# EAGLE design ESP32-S3 Parallel TFT 3.16“ ST7701S v1.0 (EAGLE 6.1)
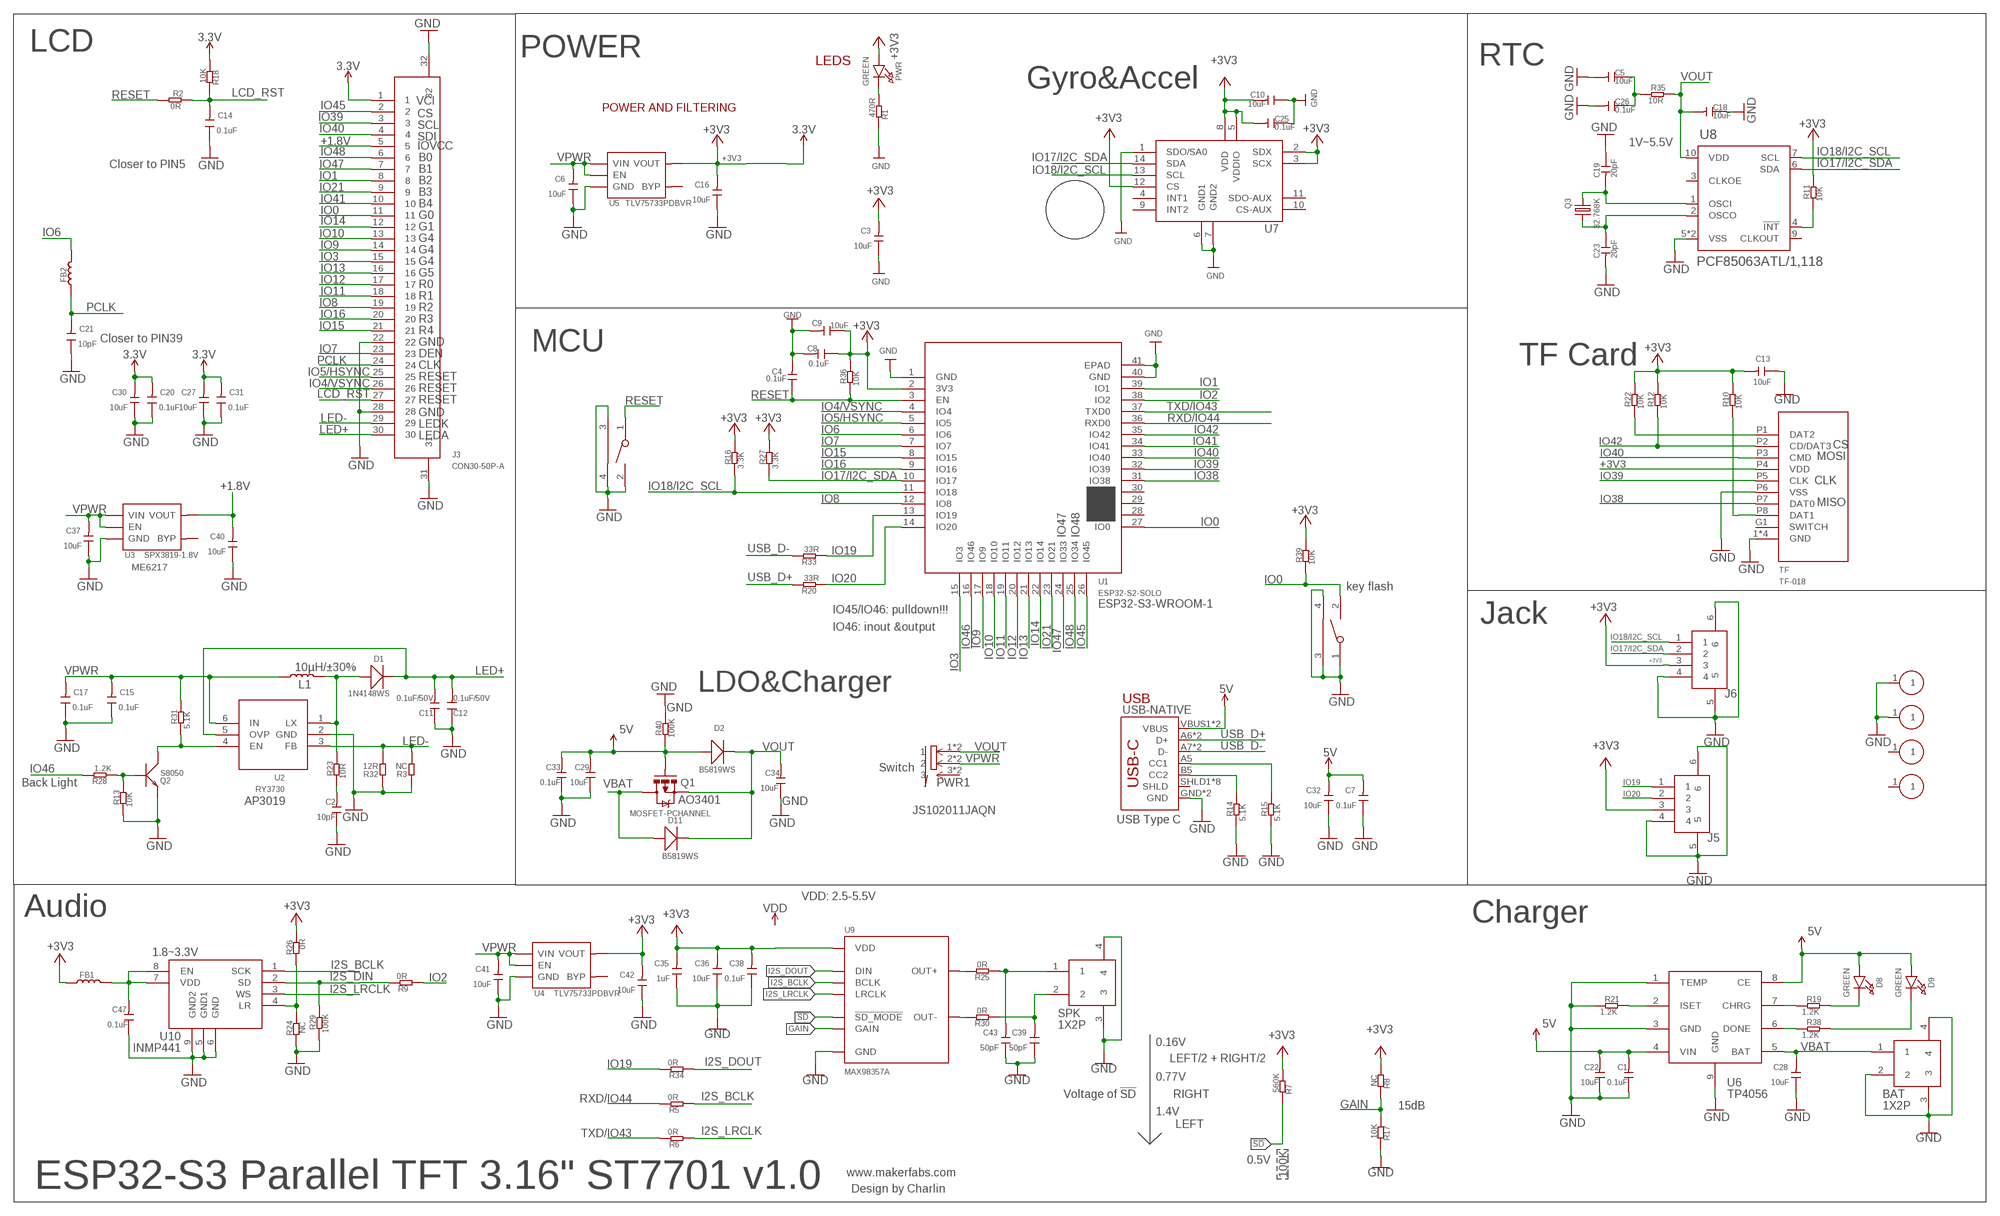
[diagram p0: schematic, sheet 1]

## Parts
BAT  1X2P  [1X2P-SMT1.25MM]
C1  0.1uF  DISCRETE_C-0402  [DISCRETE_C0402]
C2  10pF  DISCRETE_C-0402  [DISCRETE_C0402]
C3  10uF  DISCRETE_C-0402  [DISCRETE_C0402]
C4  0.1uF  DISCRETE_C-0402  [DISCRETE_C0402]
C5  10uF  DISCRETE_C-0402  [DISCRETE_C0402]
C6  10uF  DISCRETE_C-0402  [DISCRETE_C0402]
C7  0.1uF  DISCRETE_C-0402  [DISCRETE_C0402]
C8  0.1uF  DISCRETE_C-0402  [DISCRETE_C0402]
C9  10uF  DISCRETE_C-0402  [DISCRETE_C0402]
C10  10uF  DISCRETE_C-0402  [DISCRETE_C0402]
C11  0.1uF/50V  DISCRETE_C-0603  [DISCRETE_C0603]
C12  0.1uF/50V  DISCRETE_C-0603  [DISCRETE_C0603]
C13  10uF  DISCRETE_C-0402  [DISCRETE_C0402]
C14  0.1uF  DISCRETE_C-0402  [DISCRETE_C0402]
C15  0.1uF  DISCRETE_C-0402  [DISCRETE_C0402]
C16  10uF  DISCRETE_C-0402  [DISCRETE_C0402]
C17  0.1uF  DISCRETE_C-0402  [DISCRETE_C0402]
C18  10uF  DISCRETE_C-0402  [DISCRETE_C0402]
C19  20pF  DISCRETE_C-0402  [DISCRETE_C0402]
C20  0.1uF  DISCRETE_C-0402  [DISCRETE_C0402]
C21  10pF  DISCRETE_C-0402  [DISCRETE_C0402]
C22  10uF  DISCRETE_C-0402  [DISCRETE_C0402]
C23  20pF  DISCRETE_C-0402  [DISCRETE_C0402]
C25  0.1uF  DISCRETE_C-0402  [DISCRETE_C0402]
C26  0.1uF  DISCRETE_C-0402  [DISCRETE_C0402]
C27  10uF  DISCRETE_C-0402  [DISCRETE_C0402]
C28  10uF  DISCRETE_C-0402  [DISCRETE_C0402]
C29  10uF  DISCRETE_C-0402  [DISCRETE_C0402]
C30  10uF  DISCRETE_C-0402  [DISCRETE_C0402]
C31  0.1uF  DISCRETE_C-0402  [DISCRETE_C0402]
C32  10uF  DISCRETE_C-0402  [DISCRETE_C0402]
C33  0.1uF  DISCRETE_C-0402  [DISCRETE_C0402]
C34  10uF  DISCRETE_C-0402  [DISCRETE_C0402]
C35  1uF  DISCRETE_C-0402  [DISCRETE_C0402]
C36  10uF  DISCRETE_C-0402  [DISCRETE_C0402]
C37  10uF  DISCRETE_C-0402  [DISCRETE_C0402]
C38  0.1uF  DISCRETE_C-0402  [DISCRETE_C0402]
C39  50pF  DISCRETE_C-0402  [DISCRETE_C0402]
C40  10uF  DISCRETE_C-0402  [DISCRETE_C0402]
C41  10uF  DISCRETE_C-0402  [DISCRETE_C0402]
C42  10uF  DISCRETE_C-0402  [DISCRETE_C0402]
C43  50pF  DISCRETE_C-0402  [DISCRETE_C0402]
C47  0.1uF  DISCRETE_C-0402  [DISCRETE_C0402]
D1  1N4148WS  D'0805'  [SOD323]
D2  B5819WS  D'0805'  [SOD323]
D8  GREEN  LED0805_NOOUTLINE  [CHIPLED_0805_NOOUTLINE]
D9  GREEN  LED0805_NOOUTLINE  [CHIPLED_0805_NOOUTLINE]
D11  B5819WS  D'0805'  [SOD323]
FB1  L'0402'  [0402]
FB2  L'0402'  [0402]
FLASH  TS24CA  [2*4*3.5MM]
J3  CON30-50P-A  [SMD30-50P-1850L540W300H]
J5  CON4-100P-V  [SMD4-100P-635L374W374H]
J6  CON4-100P-V  [SMD4-100P-635L374W374H]
L1  10µH/±30%  INDUCTOR-CR54-3.3UH  [CR54]
PWR  GREEN  LED0805_NOOUTLINE  [CHIPLED_0805_NOOUTLINE]
PWR1  JS102011JAQN  [SMD-6-2.5MM]
Q1  MOSFET-PCHANNEL  [SOT23-3]
Q2  S8050  TRANSISTOR-NPN-SOT23  [SOT23]
Q3  32.768K  CRYSTAL_3215  [XTAL3215]
R1  470R  DISCRETE_R-0402  [DISCRETE_R0402]
R2  0R  DISCRETE_R-0402  [DISCRETE_R0402]
R3  NC  DISCRETE_R-0603  [DISCRETE_R0603]
R5  0R  DISCRETE_R-0402  [DISCRETE_R0402]
R6  0R  DISCRETE_R-0402  [DISCRETE_R0402]
R7  560K  DISCRETE_R-0402  [DISCRETE_R0402]
R8  NC  DISCRETE_R-0402  [DISCRETE_R0402]
R9  0R  DISCRETE_R-0402  [DISCRETE_R0402]
R10  10K  DISCRETE_R-0402  [DISCRETE_R0402]
R11  10K  DISCRETE_R-0402  [DISCRETE_R0402]
R12  10K  DISCRETE_R-0402  [DISCRETE_R0402]
R13  10K  DISCRETE_R-0402  [DISCRETE_R0402]
R14  5.1K  DISCRETE_R-0402  [DISCRETE_R0402]
R15  5.1K  DISCRETE_R-0402  [DISCRETE_R0402]
R16  3.3K  DISCRETE_R-0402  [DISCRETE_R0402]
R17  10K  DISCRETE_R-0402  [DISCRETE_R0402]
R18  10K  DISCRETE_R-0402  [DISCRETE_R0402]
R19  1.2K  DISCRETE_R-0402  [DISCRETE_R0402]
R20  33R  DISCRETE_R-0402  [DISCRETE_R0402]
R21  1.2K  DISCRETE_R-0402  [DISCRETE_R0402]
R22  10K  DISCRETE_R-0402  [DISCRETE_R0402]
R23  10R  DISCRETE_R-0402  [DISCRETE_R0402]
R24  NC  DISCRETE_R-0402  [DISCRETE_R0402]
R25  0R  DISCRETE_R-0402  [DISCRETE_R0402]
R26  0R  DISCRETE_R-0402  [DISCRETE_R0402]
R27  3.3K  DISCRETE_R-0402  [DISCRETE_R0402]
R28  1.2K  DISCRETE_R-0402  [DISCRETE_R0402]
R29  100K  DISCRETE_R-0402  [DISCRETE_R0402]
R30  0R  DISCRETE_R-0402  [DISCRETE_R0402]
R31  5.1K  DISCRETE_R-0402  [DISCRETE_R0402]
R32  12R  DISCRETE_R-0603  [DISCRETE_R0603]
R33  33R  DISCRETE_R-0402  [DISCRETE_R0402]
R34  0R  DISCRETE_R-0402  [DISCRETE_R0402]
R35  10R  DISCRETE_R-0402  [DISCRETE_R0402]
R36  10K  DISCRETE_R-0402  [DISCRETE_R0402]
R38  1.2K  DISCRETE_R-0402  [DISCRETE_R0402]
R39  10K  DISCRETE_R-0402  [DISCRETE_R0402]
R40  100K  DISCRETE_R-0402  [DISCRETE_R0402]
RST  TS24CA  [2*4*3.5MM]
S1  CON1-A  [THD1-210M-310D]
S2  CON1-A  [THD1-210M-310D]
S3  CON1-A  [THD1-210M-310D]
S4  CON1-A  [THD1-210M-310D]
SPK  1X2P  [1X2P-SMT1.25MM]
TF  TF-018  [TF-018]
U1  ESP32­S2­SOLO  [ESP32-­S2-­SOLO]
U2  RY3730  [SOT23-6]
U3  SPX3819-1.8V  SPX3819  [SOT23-5]
U4  TLV75733PDBVR  SPX3819  [SOT23-5]
U5  TLV75733PDBVR  SPX3819  [SOT23-5]
U6  TP4056  [SOP8-1.27P]
U7  QMI8658A  [LGA14-50P-300L250W86H]
U8  PCF85063ATL/1,118  [10-DFN(2.6X2.6)]
U9  MAX98357A  [TQFN-16]
U10  INMP441  [SMD9-105P-472L376W98H]
USB-NATIVE  USB_C5  [USB-C-16P-5]

## Nets
5V: C1.2 C7.2 C22.2 C29.2 C32.2 C33.2 D2.+ D8.A D9.A Q1.1(G) R40.1 U6.4(VIN) U6.8(CE) USB-NATIVE.VBUS1(VBUS) USB-NATIVE.VBUS2(VBUS)
!SD: R7.2 U9.P$4(!SD_MODE)
+1.8V: C40.2 J3.5 U3.5(VOUT)
+3V3: C3.2 C8.1 C9.1 C10.2 C13.2 C16.2 C20.2 C25.2 C27.2 C30.2 C31.2 C35.2 C36.2 C38.2 C42.2 FB1.1 J3.1 J5.3 J6.3 PWR.A R7.1 R8.1 R10.2 R11.2 R12.2 R16.2 R18.1 R22.2 R26.2 R27.2 R36.2 R39.2 TF.P4(VDD) U1.2(3V3) U4.5(VOUT) U5.5(VOUT) U7.2(SDX) U7.3(SCX) U7.5(VDDIO) U7.8(VDD) U7.12(CS) U9.P$7(VDD) U9.P$8(VDD) ; supply symbol labelled 3.3V
GAIN: R8.2 R17.1 U9.P$2(GAIN)
GND: BAT.2 BAT.3 BAT.4 C1.1 C2.1 C3.1 C4.2 C5.2 C6.1 C7.1 C8.2 C9.2 C10.1 C11.1 C12.1 C13.1 C14.1 C15.1 C16.1 C17.1 C18.1 C19.1 C20.1 C21.1 C22.1 C23.2 C25.1 C26.2 C27.1 C28.1 C29.1 C30.1 C31.1 C32.1 C33.1 C34.1 C35.1 C36.1 C37.1 C38.1 C39.1 C40.1 C41.1 C42.1 C43.1 C47.1 FLASH.1 FLASH.3 FLASH.4 J3.22 J3.28 J3.31 J3.32 J5.4 J5.5 J5.6 J6.4 J6.5 J6.6 Q2.2(E) R1.2 R3.1 R13.1 R14.1 R15.1 R17.2 R21.1 R24.1 R29.1 R32.1 R40.2 RST.2 RST.3 RST.4 S1.1 S2.1 SPK.3 SPK.4 TF.1(GND) TF.2(GND) TF.3(GND) TF.4(GND) TF.P6(VSS) U1.1(GND) U1.40(GND) U1.41(EPAD) U2.2(GND) U3.2(GND) U4.2(GND) U5.2(GND) U6.1(TEMP) U6.3(GND) U6.9(GND) U7.1(SDO/SA0) U7.6(GND1) U7.7(GND2) U8.5(VSS) U8.11(VSS) U9.P$3(GND) U9.P$11(GND) U9.P$15(GND) U9.P$EP(GND) U10.5(GND1) U10.6(GND) U10.9(GND2) USB-NATIVE.GND USB-NATIVE.GND2(GND)
I2S_BCLK: R5.1 U9.P$16(BCLK) U10.1(SCK)
I2S_DIN: R9.2 R29.2 U10.2(SD)
I2S_DOUT: R34.1 U9.P$1(DIN)
I2S_LRCLK: R6.1 U9.P$14(LRCLK) U10.3(WS)
IO0: FLASH.2 J3.11 R39.1 U1.27(IO0)
IO1: J3.8 U1.39(IO1)
IO2: R9.1 U1.38(IO2)
IO3: J3.15 U1.15(IO3)
IO4/VSYNC: J3.26 U1.4(IO4)
IO5/HSYNC: J3.25 U1.5(IO5)
IO6: FB2.2 U1.6(IO6)
IO7: J3.23 U1.7(IO7)
IO8: J3.19 U1.12(IO8)
IO9: J3.14 U1.17(IO9)
IO10: J3.13 U1.18(IO10)
IO11: J3.18 U1.19(IO11)
IO12: J3.17 U1.20(IO12)
IO13: J3.16 U1.21(IO13)
IO14: J3.12 U1.22(IO14)
IO15: J3.21 U1.8(IO15)
IO16: J3.20 U1.9(IO16)
IO17/I2C_SDA: J6.2 R27.1 U1.10(IO17) U7.14(SDA) U8.6(SDA)
IO18/I2C_SCL: J6.1 R16.1 U1.11(IO18) U7.13(SCL) U8.7(SCL)
IO19: J5.1 R33.1 R34.2 U1.13(IO19)
IO20: J5.2 R20.1 U1.14(IO20)
IO21: J3.9 U1.23(IO21)
IO38: TF.P7(DAT0) U1.31(IO38)
IO39: J3.3 TF.P5(CLK) U1.32(IO39)
IO40: J3.4 TF.P3(CMD) U1.33(IO40)
IO41: J3.10 U1.34(IO41)
IO42: R12.1 TF.P2(CD/DAT3) U1.35(IO42)
IO45: J3.2 U1.26(IO45)
IO46: R28.2 U1.16(IO46)
IO47: J3.7 U1.24(IO33)
IO48: J3.6 U1.25(IO34)
LCD_RST: C14.2 J3.27 R2.2 R18.2
LED+: C11.2 C12.2 D1.- J3.30 U2.5(OVP)
LED-: J3.29 R3.2 R32.2 U2.3(FB)
N$1: R22.1 TF.P1(DAT2)
N$2: R10.1 TF.P8(DAT1)
N$3: C5.1 C26.1 R35.1
N$4: C19.2 Q3.P$1 U8.1(OSCI)
N$5: R30.2 U9.P$10(OUT-)
N$6: R15.2 USB-NATIVE.A5(CC1)
N$7: PWR.C R1.1
N$8: Q2.1(B) R13.2 R28.1
N$9: C39.2 R30.1 SPK.2
N$10: R24.2 R26.1 U10.4(LR)
N$11: C47.2 FB1.2 U10.7(VDD) U10.8(EN)
N$12: R11.1 U8.4(!INT)
N$13: C23.1 Q3.P$2 U8.2(OSCO)
N$14: R14.2 USB-NATIVE.B5(CC2)
N$15: C43.2 R25.1 SPK.1
N$17: D1.+ L1.P$2 R23.2 U2.1(LX)
N$21: R25.2 U9.P$9(OUT+)
N$22: C2.2 R23.1
N$23: R21.2 U6.2(ISET)
N$24: Q2.3(C) R31.1 U2.4(EN)
N$29: R19.1 U6.7(CHRG)
N$30: R38.1 U6.6(DONE)
N$31: D8.C R19.2
N$32: D9.C R38.2
PCLK: C21.2 FB2.1 J3.24
RESET: C4.1 R2.1 R36.1 RST.1 U1.3(EN)
RXD/IO44: R5.2 U1.36(RXD0)
TXD/IO43: R6.2 U1.37(TXD0)
USB_D+: R20.2 USB-NATIVE.A6(D+) USB-NATIVE.B6(D+)
USB_D-: R33.2 USB-NATIVE.A7(D-) USB-NATIVE.B7(D-)
VBAT: BAT.1 C28.2 D11.+ Q1.3(D) U6.5(BAT)
VOUT: C18.2 C34.2 D2.- D11.- PWR1.1 PWR1.1@1 Q1.2(S) R35.2 U8.10(VDD)
VPWR: C6.2 C15.2 C17.2 C37.2 C41.2 L1.P$1 PWR1.2 PWR1.2@1 R31.2 U2.6(IN) U3.1(VIN) U3.3(EN) U4.1(VIN) U4.3(EN) U5.1(VIN) U5.3(EN)
Unconnected: PWR1.3 PWR1.3@1 S3.1 S4.1 TF.G1(SWITCH) U1.28(IO35) U1.29(IO36) U1.30(IO37) U3.4(BYP) U4.4(BYP) U5.4(BYP) U7.4(INT1) U7.9(INT2) U7.10(CS-AUX) U7.11(SDO-AUX) U8.3(CLKOE) U8.9(CLKOUT) USB-NATIVE.SHLD1(SHLD) USB-NATIVE.SHLD2(SHLD) USB-NATIVE.SHLD3(SHLD) USB-NATIVE.SHLD4(SHLD) USB-NATIVE.SHLD5(SHLD) USB-NATIVE.SHLD6(SHLD) USB-NATIVE.SHLD7(SHLD) USB-NATIVE.SHLD8(SHLD)

## Notes on the sheet
- LCD | POWER
- LEDS | RTC
- Gyro&Accel
- VCI
- POWER AND FILTERING
- CS
- SCL
- SDI
- 1V~5.5V
- IOVCC
- B0
- Closer to PIN5
- B1
- B2
- B3
- B4
- G0
- G1
- G4
- G4
- G4
- G5
- R0
- R1
- R2
- R3
- R4
- Closer to PIN39
- GND
- MCU
- DEN
- TF Card
- CLK
- RESET
- RESET
- RESET
- GND
- LEDK
- LEDA
- CS
- MOSI
- CLK
- MISO
- IO47 | IO48
- ME6217
- key flash
- ESP32-S3-WROOM-1
- IO45/IO46: pulldown!!!
- Jack
- IO46: inout &output
- LDO&Charger
- USB
- Switch
- Back Light
- AP3019 | AO3401
- USB Type C
- VDD: 2.5-5.5V
- Audio | Charger
- 1.8~3.3V
- 0.16V
- LEFT/2 + RIGHT/2
- 0.77V
- Voltage of !SD | RIGHT
- 15dB
- 1.4V
- LEFT
- 0.5V
- www.makerfabs.com | 100K
- ESP32-S3 Parallel TFT 3.16" ST7701 v1.0
- Design by Charlin

## Library data of the parts
BAT SPK = sale:1X2P
C1-C23 C25-C43 C47 = A9G:DISCRETE_C*: Ceramic Capacitors
D1 D2 D11 = Discrete:D*
D8 D9 PWR = microbuilder:LED: LED 0603 - 0603 Surface Mount Package 2mA: Green LED - Low Power (3.9mcd, 2ma, 1.7Vf) - Digikey: 475-2709-2-ND Orange LED - Low Power (9.8mcd, 2ma, 1.8Vf) - Digikey: 475-1194-2-ND Red LED - Low Power (5mcd, 2ma, 1.8Vf) - Digikey: 475-1195-2-ND Yellow LED - Low Power (7mcd, 2ma, 1.8Vf) - Digikey: 475-1196-2-ND 5mA: Blue LED - Low Power (17mcd, 5ma, 2.9Vf) - Digikey: LNJ937W8CRACT-ND 0805 - 0805 Surface Mount Package 2mA: Red LED (8.8mcd, 2mA, 1.8Vf, Clear) - Low Power [Digikey: 475-2510-1-ND] Green LED (5mcd, 2mA, 1.8Vf, Clear) - Low Power [Digikey: 475-2730-1-ND] Yellow LED (11.3mcd, 2mA, 1.8Vf, Clear) - Low Power [Digikey: 475-2555-1-ND] 20mA: Red LED (104mcd, 20mA, Diffused) - LS R976 [Digikey: 475-1278-6-ND] Red LED (12mcd, 20mA, 2.0Vf, Clear) - APT2012EC [Digikey: 754-1128-1-ND] Green LED (15mcd, 20mA, 2.2Vf, Clear) - APT2012GC [Digikey: 754-1131-1-ND] Orange LED (160mcd, 20mA, 2.1Vf, Clear) - APT2012SECK [Digikey: 754-1130-1-ND] 1206 - 1206 Surface Mount Package Green LED (26mcd, 20mA, Diffused) - LG N971 [Digikey: 475-1407-6-ND] Red LED (15mcd, 20mA, Diffused) - LH N974 [Digikey: 475-1416-6-ND] Cree - Cree High-Power Surface Mount LEDs XPEBWT-L1-0000-00D50 - White 111lm 350mA 2.9Vf 6200K 110° XTEAWT-00-0000-00000LEE3 - White 114lm 350mA 2.85Vf 5000K 115° Everlight - Everlight 45-21 Series Surface Mount LEDs 45-21/QK2C-B2832AC2CB2/2T - Warm White 2000mcd 20mA 3.25Vf 3050K 120° 45-21/LK2C-B38452C4CB2/2T - Nuetral White 2000mcd 20mA 3.25Vf 4150K 120° 45-21/LK2C-B50634C6CB2/2T - Cold White 2200mcd 20mA 3.25Vf 5650K 120° PLCC2 Reverse Mount LS T77K-J1L2-1-0-2-R18-Z - Red 11.25mcd 2mA 1.8Vf 630nm 120° LO T77K-L1M2-24-Z - Orange 19.6mcd 2mA 1.8Vf 606nm 120° LY T77K-K2M1-26-Z - Yellow 15.7mcd 2mA 1.8Vf 587nm 120°
FB1 FB2 = Discrete:L*
FLASH RST = sale:TS24CA
J3 = user:CON30-50P-A
J5 J6 = user:CON4-100P-V
L1 = SparkFun-Coils:INDUCTOR: Inductors Resist changes in electrical current. Basically a coil of wire. SparkFun Products: SparkFun Load Cell Amplifier - HX711 <https://www.sparkfun.com/products/13879> IOIO-OTG - V2.2 <https://www.sparkfun.com/products/13613>; PROD_ID: NDUC-11157; VALUE: 3.3µH/±30%/3.4A
PWR1 = sale:JS102011JAQN
Q1 = User-Submitted:MOSFET-PCHANNEL: Generic PMOSFET IRLML2244 - TRANS-11153 (SOT-23 -20V -4.3A) (1.Gate 2.Source 3.Drain) FQP27P06 - COM-10349 <http://www.sparkfun.com/products/10349> (TO-220 -60V -27A) (1.Gate 2.Source 3.Drain); PROD_ID: TRANS-08285
Q2 = Discrete:TRANSISTOR-NPN*: NPN audion
Q3 = microbuilder:CRYSTAL: Crystals HC49UP - Surface Mount Crystal 4.0MHz 18pF +/-30ppm Surface Mount Crystal [Digikey: 535-9857-1-ND] 12.0 MHz Surface Mount Crystal [Digikey: 535-9869-6-ND] 25.0 MHz Surface Mount Crystal [Digikey: 535-9078-1-ND] 2.5 x 2.0mm - MEMs SMT Crystal 16.0 MHz 10pF 20ppm 2.5 x 2.0mm Crystal [Digikey -40-85°C: 535-10923-1-ND] 3.2 x 2.5mm - MEMs SMT Crystal 12.0 MHz 8pF 15ppm 3.2 x 2.5mm Crystal [Digikey: -10-70°C: 644-1047-1-ND -40-125°C: 644-1128-1-ND] 40~85°C cheaper: 644-1173-6-ND 16.0 MHz 8pF 15ppm 3.2 x 2.5mm Crystal [Digikey: -10-70°C: 644-1049-1-ND -40-125°C: 644-1129-2-ND]-40~85°C cheaper: 644-1175-6-ND 16.0 MHz 10pF 10ppm 3.2 x 2.5mm Crystal [Digikey: 644-1100-1-ND] 27.12 MHz 18pF 30ppm 3.2 x 2.5mm Crystal [Digikey: 887-1424-1-ND] 27.12MHz 10pF 10ppm 3.2 x 2.5mm Crystal [Digikey: 887-1329-1-ND] 4.9 x 1.8mm - MEMs SMT Crystal 32.768 KHz 12.5pF 20ppm 4.9 x 1.8mm Crystal [Digikey: SE2415CT-ND] 8.0 x 3.8mm - Surface Mount Crystal 32.768kHz 12.5pF 20ppm -40°C-85°C [Digikey: 535-9166-2-ND] Cylinder 32.768KHz Cylinder Crystal (2x6mm body) [Ex. Digikey: 300-8341-2-ND]
R1-R3 R5-R36 R38-R40 = A9G:DISCRETE_R*
S1-S4 = user:CON1-A
TF = sale:TF-018
U1 = self:ESP32­S2­SOLO
U2 = sale:RY3730
U3-U5 = IC:SPX3819
U6 = self:TP4056
U7 = user:QMI8658A
U8 = SparkFun-Clocks:PCF85063ATL/1,118: NXP PCF85063ATL/1,118 - Temperature compensated RTC Provides year, month, day, weekday, hours, minutes, and seconds based on a 32.768 kHz quartz crystal Clock operating voltage: 0.9 V to 5.5 V Low current; typical 0.22uA at VDD = 3.3 V and Tamb = 25C 400 kHz two-line I2C-bus interface (at VDD = 1.8 V to 5.5 V) Programmable clock output for peripheral devices (32.768 kHz, 16.384 kHz, 8.192 kHz, 4.096 kHz, 2.048 kHz, 1.024 kHz, and 1 Hz) Selectable integrated oscillator load capacitors for CL = 7 pF or CL = 12.5 pF Alarm function Countdown timer Minute and half minute interrupt Oscillator stop detection function Internal Power-On Reset (POR) Programmable offset register for frequency adjustment; PROD_ID: IC-15415
U9 = SparkFun-IC-Amplifiers:MAX98357A: I2S DAC 3.2W (4-8ohm); PROD_ID: IC-14032
U10 = user:INMP441
USB-NATIVE = USBC:USB_C: USB Type C 16Pin Connector Super Speed pins not available on the 16-pin purely SMD connector so this part is best for USB 2.0 implementations. D1 and D2 are tied together enabling D+/- no matter which way the cable is plugged into the connector. The two channel configuration pins (CC1/2) are exposed. These are normally connected to ground via 5.1k resistors but can be reconfigured for high current/high power applications.

## Net classes
0 default: width 0.203 mm, drill 0.305 mm, clearance 0.152 mm
1 vbat: width 0.254 mm, drill 0.305 mm, clearance 0.203 mm

## Board
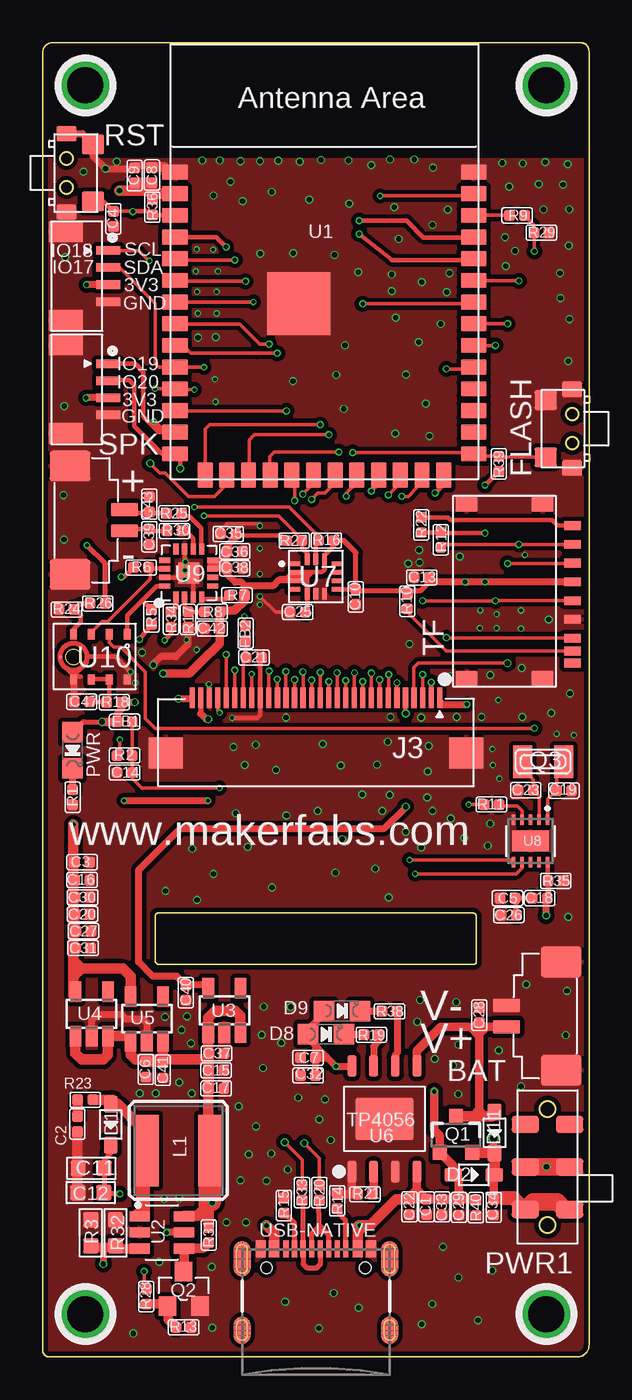
[diagram p1: board, top side]
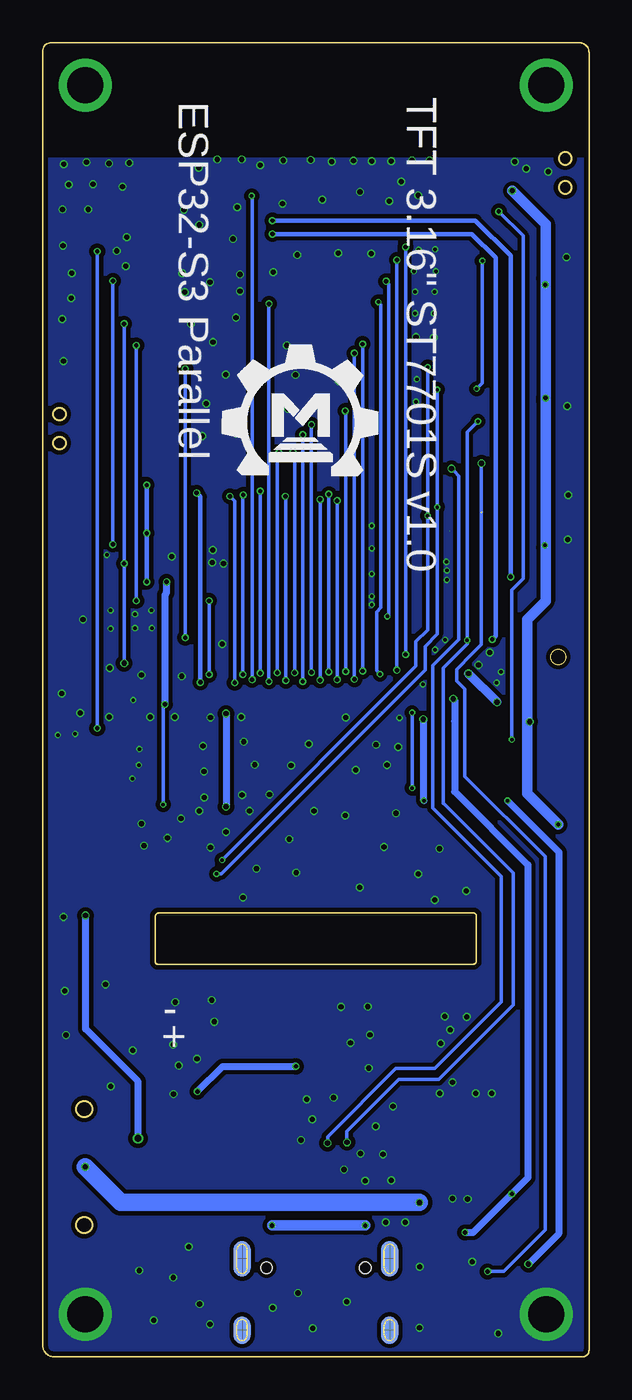
[diagram p2: board, bottom side, seen from below]

Size 32 x 77 mm. Coordinates in mm from the lower left corner, seen from the top.
Outline: 31.32,0 0.39,0 arc-90 0,0.39 0,76.43 arc-90 0.57,77 31.51,77 arc-90 32,76.51 32,0.68 arc-90 31.32,0
Outline: 25.21,26 6.76,26 arc90 6.6,25.84 6.6,23.19 arc90 6.79,23 25.27,23 arc90 25.4,23.14 25.4,25.81 arc90 25.21,26
Copper layers (1*16): Top 0.035mm / dielectric 1.5mm / Bottom 0.035mm
Design rules: minimum track width 6mil, minimum drill 8mil, track to track 6mil, track to pad 6mil, pad to pad 6mil, via to via 6mil, smd to smd 0mil, copper to edge 10mil, drill to drill 6mil, minimum pad ring 3mil, minimum via ring 3mil, stop-mask expansion 2mil, vias tented up to drill 100mil, thermal gap 0mil
tRestrict: area -6.9,70.5 to 39.1,77.3
bRestrict: area -6.1,70.5 to 39.9,77.3

### Footprints (pad centres in the part's own frame; a part is rotated, then mirrored left to right if it is on the bottom)
1X2P-SMT1.25MM = smd 0.8 x 1.6: 1 -0.625,0; 2 0.625,0 | smd 1.8 x 2.4: 3 3.175,-3.2; 4 -3.175,-3.2
DISCRETE_C0402 = smd 0.635 x 0.635: 1 -0.445,0; 2 0.445,0
DISCRETE_C0603 = smd 0.889 x 0.889: 1 -0.762,0; 2 0.762,0
SOD323 = smd 1 x 0.8: + -1.2,0; - 1.2,0
CHIPLED_0805_NOOUTLINE = smd 1.2 x 1.2: A 0,-1.05; C 0,1.05
0402 = smd 0.635 x 0.635: 1 -0.445,0; 2 0.445,0
2*4*3.5MM = smd 1.15 x 1.3: 1 -1.675,0; 2 1.675,0 | smd 0.9 x 1.2: 3 2.3,1.55; 4 -2.3,1.55
SMD30-50P-1850L540W300H = smd 0.3 x 1.2: 1 7.25,1.625; 2 6.75,1.625; 3 6.25,1.625; 4 5.75,1.625; 5 5.25,1.625; 6 4.75,1.625; 7 4.25,1.625; 8 3.75,1.625; 9 3.25,1.625; 10 2.75,1.625; 11 2.25,1.625; 12 1.75,1.625; 13 1.25,1.625; 14 0.75,1.625; 15 0.25,1.625; 16 -0.25,1.625; 17 -0.75,1.625; 18 -1.25,1.625; 19 -1.75,1.625; 20 -2.25,1.625; 21 -2.75,1.625; 22 -3.25,1.625; 23 -3.75,1.625; 24 -4.25,1.625; 25 -4.75,1.625; 26 -5.25,1.625; 27 -5.75,1.625; 28 -6.25,1.625; 29 -6.75,1.625; 30 -7.25,1.625 | smd 2 x 1.8: 31 -8.8,-1.625; 32 8.8,-1.625
SMD4-100P-635L374W374H = smd 0.5 x 1.4: 1 -1.5,1.243; 2 -0.5,1.243; 3 0.5,1.243; 4 1.5,1.243 | smd 1.2 x 2: 5 -2.595,-1.243; 6 2.595,-1.243
CR54 = smd 4.2 x 1.4: P$1 0,1.85; P$2 0,-1.85
SMD-6-2.5MM = smd 1 x 1.6: 1 -2.5,1.3; 1@1 -2.5,-1.3; 2 0,1.3; 2@1 0,-1.3; 3 2.5,1.3; 3@1 2.5,-1.3
SOT23-3 = smd 0.8 x 0.9: 1 -0.95,-1; 2 0.95,-1; 3 0,1.1
SOT23 = smd 1.016 x 1.143: 1 -0.95,-1.016; 2 0.95,-1.016; 3 0,1.016
XTAL3215 = smd 1.1 x 1.9: P$1 1.2,0; P$2 -1.2,0
DISCRETE_R0402 = smd 0.635 x 0.635: 1 -0.445,0; 2 0.445,0
DISCRETE_R0603 = smd 0.889 x 0.889: 1 -0.762,0; 2 0.762,0
THD1-210M-310D = drill 2.1 pad 3.1: 1 0,0
TF-018 = smd 1 x 1.3: 1 -5.15,2.225; 2 -5.15,-2.225; 3 5.15,-2.225; 4 5.15,2.225 | smd 0.5 x 1: G1 -4.2,-3.975; P1 3.85,-3.975; P2 2.75,-3.975; P3 1.65,-3.975; P4 0.55,-3.975; P5 -0.55,-3.975; P6 -1.65,-3.975; P7 -2.75,-3.975; P8 -3.5,-3.975
ESP32-­S2-­SOLO = smd 1.5 x 0.9: 1 -8.75,5.26; 2 -8.75,3.99; 3 -8.75,2.72; 4 -8.75,1.45; 5 -8.75,0.18; 6 -8.75,-1.09; 7 -8.75,-2.36; 8 -8.75,-3.63; 9 -8.75,-4.9; 10 -8.75,-6.17; 11 -8.75,-7.44; 12 -8.75,-8.71; 13 -8.75,-9.98; 14 -8.75,-11.25; 27 8.75,-11.25; 28 8.75,-9.98; 29 8.75,-8.71; 30 8.75,-7.44; 31 8.75,-6.17; 32 8.75,-4.9; 33 8.75,-3.63; 34 8.75,-2.36; 35 8.75,-1.09; 36 8.75,0.18; 37 8.75,1.45; 38 8.75,2.72; 39 8.75,3.99; 40 8.75,5.26 | smd 0.9 x 1.5: 15 -6.985,-12.5; 16 -5.715,-12.5; 17 -4.445,-12.5; 18 -3.175,-12.5; 19 -1.905,-12.5; 20 -0.635,-12.5; 21 0.635,-12.5; 22 1.905,-12.5; 23 3.175,-12.5; 24 4.445,-12.5; 25 5.715,-12.5; 26 6.985,-12.5 | smd 3.7 x 3.7: 41 -1.5,-2.46
SOT23-6 = smd 1.2 x 0.6: 1 -1.3,0.95; 2 -1.3,0; 3 -1.3,-0.95; 4 1.3,-0.95; 5 1.3,0; 6 1.3,0.95
SOT23-5 = smd 0.69 x 1.2: 1 -0.95,-1.3; 2 0,-1.3; 3 0.95,-1.3; 4 0.95,1.3; 5 -0.95,1.3
SOP8-1.27P = smd 1.27 x 0.51: 1 -3.1,1.905; 2 -3.1,0.635; 3 -3.1,-0.635; 4 -3.1,-1.905; 5 3.1,-1.905; 6 3.1,-0.635; 7 3.1,0.635; 8 3.1,1.905 | smd 2.5 x 3.4: 9 0,0
LGA14-50P-300L250W86H = smd 0.675 x 0.28: 1 -1.262,0.75; 2 -1.262,0.25; 3 -1.262,-0.25; 4 -1.262,-0.75; 8 1.262,-0.75; 9 1.262,-0.25; 10 1.262,0.25; 11 1.262,0.75 | smd 0.28 x 0.675: 5 -0.5,-1.012; 6 0,-1.012; 7 0.5,-1.012; 12 0.5,1.012; 13 0,1.012; 14 -0.5,1.012
10-DFN(2.6X2.6) = smd 0.61 x 0.203: 1 -1.245,1; 2 -1.245,0.5; 3 -1.245,0; 4 -1.245,-0.5; 5 -1.245,-1; 6 1.245,-1; 7 1.245,-0.5; 8 1.245,0; 9 1.245,0.5; 10 1.245,1 | smd 1.245 x 2.159: 11 0,0
TQFN-16 = smd 0.3 x 0.65: P$1 -0.75,-1.4; P$2 -0.25,-1.4; P$3 0.25,-1.4; P$4 0.75,-1.4; P$9 0.75,1.4; P$10 0.25,1.4; P$11 -0.25,1.4; P$12 -0.75,1.4 | smd 0.65 x 0.3: P$5 1.4,-0.75; P$6 1.4,-0.25; P$7 1.4,0.25; P$8 1.4,0.75; P$13 -1.4,0.75; P$14 -1.4,0.25; P$15 -1.4,-0.25; P$16 -1.4,-0.75 | smd 1.23 x 1.23: P$EP 0,0
SMD9-105P-472L376W98H = smd 0.4 x 0.6: 1 0,0; 2 -1.05,0; 3 -2.1,0; 4 -3.15,0; 6 -3.15,-2.66; 7 -2.1,-2.66; 8 -1.05,-2.66; 9 0,-2.66 | smd 0.2 x 0.2: 5 -3.9,-1.33
USB-C-16P-5 = smd 0.3 x 1: A5 -1.25,-0.34; A6 -0.25,-0.34; A7 0.25,-0.34; A8 1.25,-0.34; B5 1.75,-0.34; B6 0.75,-0.34; B7 -0.75,-0.34; B8 -1.75,-0.34 | smd 0.6 x 1: GND -3.225,-0.34; GND2 3.225,-0.34; VBUS1 -2.45,-0.34; VBUS2 2.45,-0.34 | smd 1 x 2.1: SHLD1 -4.32,-0.915; SHLD2 4.32,-0.915 | smd 1 x 2.1 bottom: SHLD3 -4.32,-0.915; SHLD4 4.32,-0.915 | smd 1 x 1.6: SHLD5 -4.32,-5.095; SHLD8 4.32,-5.095 | smd 1 x 1.6 bottom: SHLD6 -4.32,-5.095; SHLD7 4.32,-5.095 | hole 0.65: -2.89,-1.445; 2.89,-1.445

### Placement (x,y rotation side)
BAT  27.18,19.96 90 top
C1  22.48,8.79 90 top
C2  2.03,13.64 90 top
C3  2.31,28.98 180 top
C4  4.14,66.67 270 top
C5  27.23,26.87 180 top
C6  6.05,16.84 90 top
C7  15.54,17.53 0 top
C8  6.4,69.24 90 top
C9  5.38,69.22 90 top
C10  18.34,44.53 90 top
C11  2.84,11.05 0 top
C12  2.82,9.63 0 top
C13  22.2,45.67 0 top
C14  4.8,34.24 0 top
C15  10.16,16.79 180 top
C16  2.31,27.94 180 top
C17  10.16,15.72 180 top
C18  30.05,27.89 180 top
C19  30.53,33.17 180 top
C20  2.34,25.93 180 top
C21  12.37,40.97 180 top
C22  21.49,8.79 90 top
C23  28.3,33.2 180 top
C25  14.94,43.64 0 top
C26  27.3,25.88 180 top
C27  2.39,24.94 180 top
C28  25.58,20.02 270 top
C29  24.38,8.76 90 top
C30  2.34,26.92 180 top
C31  2.36,23.95 180 top
C32  15.54,16.48 0 top
C33  23.39,8.79 90 top
C34  26.42,8.76 90 top
C35  10.87,48.21 0 top
C36  11.25,47.19 180 top
C37  10.19,17.78 180 top
C38  11.25,46.2 180 top
C39  6.25,48.06 90 top
C40  8.38,21.34 90 top
C41  7.04,16.79 90 top
C42  9.93,42.67 0 top
C43  6.25,49.96 270 top
C47  2.29,38.38 0 top
D1  3.99,13.61 270 top
D2  25.25,10.67 0 top
D8  16.59,18.9 270 top
D9  17.53,20.27 270 top
D11  26.47,13.13 270 top
FB1  4.19,38.35 180 top
FB2  11.89,42.39 90 top
FLASH  29.46,54.38 270 top
J3  16,37 0 top
J5  2.59,56.69 270 top
J6  2.59,63.32 270 top
L1  7.95,12.09 270 top
PWR  1.75,35.54 180 top
PWR1  29.57,11.13 90 top
Q1  24.21,12.98 0 top
Q2  8.26,3.99 0 top
Q3  29.31,34.87 0 top
R1  1.75,32.79 270 top
R2  4.8,35.23 0 top
R3  2.82,7.26 270 top
R5  6.38,43.36 270 top
R6  5.77,46.25 180 top
R7  11.38,44.63 180 top
R8  9.93,43.66 180 top
R9  27.79,66.88 0 top
R10  21.36,44.27 90 top
R11  26.29,32.36 180 top
R12  23.32,47.88 90 top
R13  8.26,1.73 180 top
R14  17.25,9.14 270 top
R15  14.12,8.86 270 top
R16  16.61,47.83 0 top
R17  8.51,43.21 270 top
R18  4.8,37.21 0 top
R19  19.25,18.87 180 top
R20  16.21,9.63 270 top
R21  18.87,9.53 0 top
R22  22.17,48.74 270 top
R23  2.49,15.06 0 top
R24  1.4,43.79 0 top
R25  7.7,49.43 0 top
R26  3.23,44.15 0 top
R27  14.73,47.83 180 top
R28  6.07,3.53 90 top
R29  29.21,65.86 180 top
R30  7.72,48.39 0 top
R31  9.73,7.14 90 top
R32  4.27,7.26 270 top
R33  15.19,9.63 270 top
R34  7.52,43.21 270 top
R35  29.11,26.87 0 top
R36  6.43,67.36 90 top
R38  20.32,20.24 180 top
R39  26.72,52.32 270 top
R40  25.37,8.74 270 top
RST  2.95,69.37 90 top
S1  2.5,2.5 0 top
S2  29.5,2.5 0 top
S3  29.5,74.5 0 top
S4  2.5,74.5 0 top
SPK  4.8,49.02 270 top
TF  27.05,44.86 90 top
U1  16.5,64.16 0 top
U2  6.99,7.29 0 top
U3  10.64,20.29 0 top
U4  2.87,20.09 0 top
U5  6.1,19.81 0 top
U6  20.02,13.94 90 top
U7  16,45.72 0 top
U8  28.57,30.23 270 top
U9  8.56,45.92 0 top
U10  4.95,42.34 0 top
U$1  [MAKERFABS_0.3]  21.01,51.67 0 bottom
USB-NATIVE  16,6.66 0 top

### Tracks (layer width: path | path; a pad name or v marks a point on that pad's centre or on a via)
5V  (via drill 0.25)
  Top 0.305: 16,18.09 15.75,18.44
  Top 0.406: 17.98,17.02 v17.17,17.02 16.61,17.58 | 17.98,17.02 18.09,17.02 U6.8 18.08,17.02 17.98,17.02 | D9.A 16.48,20.13 15.75,19.41 15.75,18.44 | 15.75,18.44 16.61,17.58 | 15.75,18.44 15.75,18.69 D8.A | C32.2 16,16.48 16,18.09 | C7.2 16.61,17.53 16.61,17.58 | 25.35,9.17 R40.1 | 18.47,7.16 18.85,7.54 18.57,7.54 v18.57,7.7 | 21.31,9.27 21.92,9.88 22.53,9.27 | 23.9,9.27 24.36,9.73 24.84,9.25
  Top 0.508: 21.92,9.23 C22.2 21.92,9.23 | 21.92,9.23 C1.2 | C1.2 C33.2 | C33.2 25.29,9.23 | 25.29,9.23 arc-90 25.35,9.17 | U6.4 21.92,9.88 21.92,9.23 | 25.29,9.23 25.27,9.25 24.84,9.25 21.95,9.25 21.96,9.23 C1.2 | 21.92,9.23 21.93,9.22 22.05,9.22 22.61,9.22 22.62,9.23 C33.2 | C33.2 23.42,9.21 C29.2 24.38,10.33 D2.+ 24.05,11.19 Q1.1 23.26,12.94 22.94,13.26 v22.94,15.54
  Top 0.61: USB-NATIVE.VBUS1 13.55,7.25 v13.11,7.7 | C22.2 20.71,9.23 20.68,9.2 19.18,7.7 v18.57,7.7 arc90 18.45,7.58 USB-NATIVE.VBUS2
  Bottom 0.406: v22.94,15.54 21.46,17.02 v17.17,17.02 17.2,17.04 17.25,17.04
  Bottom 0.61: v13.11,7.7 v18.57,7.7
!SD
  Top 0.254: R7.2 10.71,44.4 9.32,44.4 9.3,44.42 9.3,44.53 U9.P$4
+1.8V  (via drill 0.3)
  Top 0.254: J3.5 21.25,37.7 v21.26,37.69
  Top 0.406: 9.81,21.72 U3.5 9.51,21.78 8.45,21.78 8.43,21.77 8.39,21.77 C40.2 7.86,22.3 6.45,22.3 5.61,23.14 5.61,28.52 8.05,30.96 20.02,30.96 21.29,32.23 v21.26,32.23
  Bottom 0.406: v21.26,37.69 v21.26,32.23
+3V3  (via drill 0.2, 0.25, 0.3)
  Top 0.203: R10.2 21.46,44.82 21.46,44.88 | R11.2 v24.94,32.36 | PWR.A 1.82,36.59 2.44,37.21 v3.48,37.21 3.53,37.16 3.63,37.16 3.63,37.21 | 11.43,48.13 11.4,48.13 C35.2 | R27.2 14.25,47.83 14.2,47.88 | U9.P$7 9.96,46.2 | 18.27,44.97 C10.2 | 1.8,21.18 1.8,21.27 U4.5 | 14.78,45.8 arc90 14.96,45.62 15.47,45.62 15.09,45.62 14.99,45.52 15.06,45.52 15.47,45.11 | v24.84,38.23 24.82,38.25 23.57,38.25 23.55,38.28 23.52,38.28 23.29,38.51
  Top 0.254: C36.2 10.81,46.67 U9.P$8 9.78,46.67 9.78,46.18 9.78,46.17 U9.P$7 | 15.49,45.97 U7.2 U7.3 | 15.49,45.97 16.35,45.97 16.51,46.13 U7.12 16.5,46.95 17.07,47.52 17.07,47.8 17.04,47.83 | C25.2 15.5,43.76 U7.5 15.5,45.96 15.49,45.97 | U7.8 18.27,44.97 18.34,45.03 | 17.04,47.83 R16.2 | R16.2 17.09,47.83 R16.2 | R16.2 17.04,47.83 | 17.04,47.83 17.02,47.83 | R22.2 23.25,48.3 23.28,48.32 R12.2 23.37,48.26 v25.91,48.26 | R39.2 v25.92,51.08 v25.91,51.08 | R10.2 21.36,44.83 21.34,44.86 20.19,44.86 | 14.63,45.54 14.55,45.54 14.53,45.52 14.53,45.9 14.58,45.95 14.99,45.95 15.16,45.95 15.49,45.62 15.49,45.36 15.42,45.36 14.91,45.87 14.76,45.87 14.68,45.8 14.78,45.8 | 15.47,45.62 15.49,45.64 15.49,45.7 15.72,45.92 14.73,45.92 14.71,45.9 14.71,45.54 | FB1.1 4.67,38.33 4.67,38.23 4.5,38.23 4.47,38.2 4.47,37.8 4.39,37.72 4.39,37.31 4.29,37.21 3.63,37.21 3.53,37.21 | v25.91,45.41 v24.74,45.41 | 11.43,48.13 13.95,48.13 14.2,47.88
  Top 0.305: 22.65,45.41 22.13,44.88 21.46,44.88 18.95,44.88 18.48,44.88 C10.2 | J3.1 23.25,38.24 23.27,38.23 23.44,38.23 | R7.1 11.82,44.31 | 10.43,43.71 R8.1 | PWR.A 2.37,37.21 2.44,37.21 v3.48,37.21 | 4.39,37.25 R18.1 | U7.3 14.74,45.82 14.63,45.92 14.63,45.54 | 18.34,45.03 18.34,47.12 17.63,47.83 R16.2 | R16.2 17.04,47.83 R16.2 | R26.2 3.67,44.92 3.67,46.47 v2.59,47.55 | 9.96,46.2 9.96,46.61 10.21,46.61 10.19,46.61 10.19,46.23 10.54,46.23 10.54,46.61 10.34,46.61 10.34,46.3 | 10.34,46.3 10.34,46.25 | 10.29,46.61 10.69,47.02 10.69,45.95 10.34,46.3
  Top 0.406: TF.P4 v25.91,45.41 24.97,45.41 | 24.97,45.41 v24.74,45.41 | v24.74,45.41 22.65,45.41 C13.2 | J6.3 2.57,62.82 v2.56,62.81 | J5.3 2.55,56.19 v2.54,56.19 | 23.25,48.3 arc-90 23.27,48.28 | 23.44,38.23 v24.84,38.23 | v24.74,45.41 24.97,45.41 | 4.39,37.25 4.39,37.72 4.64,37.96 FB1.1 v5.38,38.35 | C16.2 C3.2 1.8,28.98 1.8,28.93 1.85,28.93 1.87,28.93 C16.2 | C16.2 1.89,27.94 C30.2 C20.2 1.94,25.93 C27.2 | C31.2 1.8,23.95 1.8,23.8 1.92,23.8 | R7.1 11.82,45.2 | 11.82,45.2 11.63,45.39 11.28,45.39 10.79,45.87 | 10.79,45.87 10.79,47.32 | 10.79,47.32 10.79,47.21 C36.2 | 10.79,45.87 10.79,46.2 10.82,46.23 C38.2 | 11.82,45.2 13.53,45.2 13.87,45.54 | 14.71,45.54 13.87,45.54 | 10.79,47.32 10.79,47.5 11.43,48.13 | 13.87,45.54 14.3,45.54 14.55,45.8
  Top 0.508: R8.1 C42.2 | 11.82,44.31 11.23,43.71 10.43,43.71 | R18.1 4.29,37.21 3.63,37.21 3.53,37.21 v3.48,37.21 | 10.36,42.66 10.36,41.81 9.26,40.7 8.59,40.03 v7.06,40.03
  Top 0.61: 6.43,68.15 6.43,68.8 C8.1 5.38,68.8 C9.1 | 6.43,68.15 R36.2 | U1.2 6.43,68.15 | 6.43,68.15 R36.2 | R36.2 6.43,68.15 | 6.43,68.15 6.4,68.15 6.4,68.33 v4.5,68.33 | v1.8,31.19 1.8,28.93 1.8,23.8 1.8,23.27 | 1.8,23.27 1.8,22.28 | 1.8,22.28 1.8,21.18 1.85,21.13 | 10.36,42.66 C42.2 | U5.5 5.16,21.42 5.16,22.3 4.7,22.76 1.91,22.76 1.8,22.66 1.8,22.28 | 1.8,22.28 2.26,22.73 2.29,22.73 1.8,23.22 1.8,23.27
  Bottom 0.203: v24.94,32.36 24.94,38.2 v24.84,38.23 24.82,38.25 24.84,38.25 | 3.63,33.02 3.63,37.06 v3.48,37.21 | 2.54,47.42 2.54,47.5 v2.59,47.55
  Bottom 0.254: v25.91,51.08 v25.91,48.26 v25.91,45.41
  Bottom 0.305: v3.48,37.21 3.48,37.24 | v2.59,47.55 2.59,45.39
  Bottom 0.406: v2.56,62.81 2.56,63.17 2.54,63.2 | v2.54,56.19 2.54,56.01 | v24.74,45.41 24.74,44.76 24.84,44.65 24.84,38.25
  Bottom 0.508: v5.38,38.35 v7.06,40.03
  Bottom 0.61: v4.5,68.33 2.54,66.37 2.54,63.2 v2.54,56.19 2.54,56.01 2.54,47.42 2.54,44.3 3.63,43.2 3.63,33.02 v1.8,31.19
GAIN
  Top 0.254: R8.2 9.47,43.65 R17.1 8.31,43.65 U9.P$2
GND  (via drill 0.2, 0.3)
  Top 0.203: C25.1 13.66,43.64 v12.72,44.55 | C35.1 10.43,48.45 10.77,48.79 10.77,48.82 12.65,48.82 12.75,48.72 | J3.28 9.73,38.65 9.73,39.34 v9.73,39.4 | v9.73,39.4 9.65,39.42 v9.73,39.4 | U10.5 1.05,40.63 1.73,39.95 1.73,39.76 U10.6
  Top 0.254: U9.P$3 8.81,45.92 | 8.81,45.92 U9.P$EP | U9.P$15 8.31,45.67 arc90 U9.P$EP | C42.1 8.6,42.67 arc-90 R17.2 8.56,42.71 8.56,42.62 | U9.P$11 8.31,46.17 U9.P$EP | 8.81,45.92 8.43,45.92 | 8.56,42.62 8.56,42.6 8.56,42.62 | v5.16,40.13 4.24,41.05 3.23,41.05 3.2,41.02 2.59,41.02 2.59,40.69 2.39,40.49 2.08,40.18 1.91,40.18 2.01,40.18 2.01,39.9 2.06,39.85 | U10.6 1.85,39.73 1.85,40.18 1.88,40.16 1.88,39.88 1.91,39.85 2.06,39.85 | 2.06,39.85 2.23,39.85 2.06,39.85 | 12.85,40.95 12.75,40.95 J3.22 12.75,37.62 12.57,37.44 v11.1,37.44
  Top 0.406: R17.2 8.51,41.73 7.8,41.02 6.91,41.02 6.45,40.56 v6.48,40.54 | U10.6 1.83,39.66 1.83,38.43 | U4.2 2.87,19.71 3.23,20.07 4.6,20.07 4.88,19.79 5.87,19.79 6.1,19.56 6.1,18.82 | 6.1,18.82 6.1,18.72 6.07,18.69 6.07,18.8 6.1,18.82 | RST.3 2.32,71.67 RST.2 2.95,70.36 v3.68,69.62 5.35,69.62 C9.2 5.52,69.8 7.16,69.8 7.54,69.42 U1.1 | C8.2 7.49,69.69 U1.1 | U1.1 7.77,69.42 | 7.77,69.42 7.8,69.39 7.77,69.42
  Top 0.508: U6.1 18.11,9.84 arc90 R21.1 17.31,9.53 arc-90 R14.1
  Top 0.61: C2.1 2.03,9.73 | 2.03,9.73 2.03,9.65 | 2.03,9.65 C12.1 | 2.03,9.65 2.01,9.65 1.98,9.63 1.98,9.68 2.03,9.73 | 2.03,9.73 2.03,11 C11.1
  other vias: 30.3,63.5 2.39,69.44 9.35,70.1 13.79,70.08 16.31,70.13 30.76,69.88 24.03,17.07 23.9,31.55 10.01,28.3 13.44,27.51 20.27,26.92 17.14,28.37 12.01,29.87 14.2,3.23 23.44,6.45 25.5,2.13 10.36,70.1 1.32,64.44 9.04,26.77 11.84,34.67 7.19,27.3 18.52,2.87 11.3,31.85 12.06,11.86 22.2,1.91 5.31,1.37 14.27,31.72 22.81,3.1 26.34,5.05 10.01,68.05 26.92,69.95 12.73,70.05 13.41,68.25 17.91,70.1 30.48,68.68 17.2,57.53 22.86,69.67 1.27,55.7 16.18,1.68 8.33,45.52 8.36,46.58 8.33,46.08 11.18,35.74 12.47,35.86 19.89,31.98 20.32,32.92 18.72,32.94 16.41,35.92 20.22,36.04 5.82,41.27 5.41,39.5 14.25,37.47 20.37,37.49 22.17,37.47 24.26,37.49 25.7,37.49 28.09,37.49 23.85,39.88 26.21,39.95 28.07,40.36 9.02,41.43 8.43,42.01 24.43,46.89 22.05,47.27 21.41,46.48 22.07,46.53 12.73,45.87 12.73,47.37 12.73,44.07 12.73,48.69 28.24,46.99 28.02,43.74 28.02,42.67 25.63,43.74 26.59,42.7 25.6,42.7 26.59,43.51 26.7,38.48 26.34,35.61 26.37,34.67 26.75,33.88 30.1,36.5 31.11,36.42 9.09,59.72 10.13,59.74 10.08,57.28 10.13,55.96 9.09,61.14 10.19,61.14 9.04,62.41 10.19,62.41 8.97,63.6 10.26,63.6 9.02,64.9 9.98,64.87 20.65,54.1 23.32,60.53 20.68,60.88 22.66,53.95 21.29,57.56 20.45,62.43 20.45,63.42 23.83,63.5 23.67,62.38 22.2,62.97 20.85,65.51 23.72,67.21 22.83,66.32 20.6,67.36 19.25,69.82 20.35,70.15 21.77,70.15 15.06,70.03 30.78,58.34 7.16,19.91 8.46,19.94 8.69,18.36 8.13,19.15 5.69,15.44 6.63,15.44 8,16.08 8.74,15.44 11.48,14.68 11.58,10.34 14.35,10.97 12.5,13.51 13.39,11.91 13.11,10.31 11.91,7.87 10.77,7.87 8,9.27 7.11,9.25 6.83,5.56 9.91,5.28 9.93,1.7 17.04,3.73 24.36,4.65 16.54,15.09 16.87,12.7 14.96,15.19 16.21,13.92 12.9,16.92 12.95,20.52 14.53,20.5 13.97,18.39 12.83,18.87 21.95,19.63 24.23,20.78 22.1,20.9 24.36,18.29 22.96,17.45 24.33,15.39 26.72,17.96 28.02,15.85 30.63,18.85 30.71,21.44 28.32,21.82 30.78,25.78 26.06,29.95 26.21,31.24 24.69,30.4 22.83,31.98 22.61,35.79 22.56,34.29 22.53,32.77 19.58,34.7 17.45,34.65 13.67,34.39 16.1,31.98 17.55,30.33 19.48,28.6 30.89,38.86 29.79,37.72 29.64,43.21 21.49,41.76 22.43,55.85 14.66,57.18 17.63,55.55 17.7,59.26 18.49,63.55 12.75,64.64 14.68,64.67 17.09,64.57 17.96,67.56 15.62,67.79 11.71,67.72 11.58,70.05 4.34,70.03 27.33,68.55 11,68.86 28.12,69.93 29.44,70 29.06,68.71 30.84,67.23 29.34,67.23 27.08,65.61 27.13,63.91 27.66,64.8 30.86,60.81 30.81,65.1 30.33,62.03 1.24,47.88 1.22,50.5 8.76,29.77 22.02,59.46 22.17,29.84 21.26,30.76
  pour Top (isolate 0.254, rank 6): -10,85 -10,-5 85,-5 85,85
  pour Bottom (isolate 0.254, rank 6): -11,-5 85,-5 85,85 -11,85
I2S_BCLK
  Top 0.254: U10.1 4.95,43.43 5.84,44.32 | 5.84,44.32 6.68,45.16 7.11,45.16 7.14,45.19 7.15,45.19 U9.P$16 | R5.1 6.36,43.8 5.84,44.32
I2S_DIN  (via drill 0.25)
  Top 0.203: v28.8,36.83 8.59,36.83 6.58,36.83 6.22,37.19 6.02,37.39 6.02,40.13 4.57,41.58 4.17,41.58 3.9,41.84 U10.2 3.9,42.3 3.91,42.29 3.91,42.01 | v28.8,64.77 28.8,65.82 | R29.2 28.77,66.34 R9.2 | 3.94,42.29 3.94,42.27 3.91,42.24 3.91,42.01 | 3.91,42.01 3.91,42.32
  Top 0.254: 3.94,42.29 3.91,42.32 3.9,42.33 U10.2 | 28.8,65.82 R29.2
  Bottom 0.203: v28.8,64.77 v28.8,36.83
I2S_DOUT
  Top 0.254: U9.P$1 7.81,43.94 R34.1
I2S_LRCLK
  Top 0.203: 6.29,46.17 6.29,45.56 3.81,43.08 3.48,43.08 2.85,42.44 U10.3
  Top 0.254: U9.P$14 6.29,46.17 arc-90 R6.1 | U10.3
IO0  (via drill 0.25)
  Top 0.203: J3.11 v18.25,40.07 v18.26,40.08 | v18.16,52.98 25.27,52.98 25.32,52.93 25.27,52.93 U1.27 25.39,52.77 R39.1 26.78,52.71 FLASH.2
  Bottom 0.203: v18.16,52.98 18.26,52.88 v18.26,40.08 | v18.26,40.08 18.26,40.06 v18.26,40.08
IO1  (via drill 0.2, 0.25)
  Top 0.203: J3.8 19.74,38.64 v19.74,39.67 | v19.76,68.02 25.2,68.02 arc90 25.3,68.12 25.27,68.12 U1.39 | U1.39
  Bottom 0.203: v19.74,39.67 19.74,68.02 v19.76,68.02
IO2
  Top 0.203: U1.38 R9.1
  Top 0.254: R9.1
IO3  (via drill 0.25)
  Top 0.203: J3.15 v16.25,40.1 v16.26,40.11 | v16.26,54.61 9.78,54.61 9.52,54.35 U1.15
  Bottom 0.203: v16.26,40.11 16.26,48.56 v16.26,54.61
IO4/VSYNC  (via drill 0.25)
  Top 0.203: J3.26 10.75,39.67 v10.75,41.15 v10.74,41.15
  Top 0.254: U1.4 10.16,65.61 v10.74,65.02
  Bottom 0.203: v10.74,41.15 v10.74,65.02
IO5/HSYNC  (via drill 0.25)
  Top 0.203: J3.25 11.25,40.08 v11.25,40.23 | v11.25,64.26 7.9,64.26 7.85,64.31 7.82,64.34 U1.5
  Bottom 0.203: v11.25,40.23 v11.25,64.26
IO6  (via drill 0.2, 0.25)
  Top 0.203: v11.89,63.02 7.8,63.02 U1.6 | v11.81,43.38 11.81,42.88 11.84,42.85 FB2.2 11.91,42.82 | 11.91,42.82 11.89,42.82 | FB2.2 11.91,42.82
  Bottom 0.203: v11.89,63.02 11.73,62.87 11.73,62.71 11.73,43.84 11.73,43.64 11.73,43.46 v11.81,43.38
IO7  (via drill 0.2)
  Top 0.203: v12.34,61.8 U1.7 | J3.23 v12.25,40.01 v12.24,40.01
  Bottom 0.203: 12.45,40.31 12.45,40.34 | v12.24,40.01 12.45,40.21 12.45,40.31 | 12.45,40.31 12.45,40.34 | 12.45,40.34 12.45,40.31 | 12.45,40.34 12.45,43.64 12.19,43.89 12.19,61.57 12.19,61.65 v12.34,61.8
IO8  (via drill 0.25)
  Top 0.203: J3.19 v14.25,40.16 | v14.28,55.42 7.77,55.42 U1.12
  Bottom 0.203: v14.25,40.16 14.25,55.4 v14.28,55.42
IO9  (via drill 0.25)
  Top 0.203: J3.14 16.75,39.56 v16.76,39.57 | v16.76,54.03 12.39,54.03 12.09,53.72 12.09,51.7 U1.17
  Bottom 0.203: v16.76,39.57 v16.76,54.03
IO10  (via drill 0.25)
  Top 0.203: J3.13 v17.25,40.08 | v17.35,53.01 13.56,53.01 13.31,52.76 13.31,51.68 U1.18
  Bottom 0.203: v17.25,40.08 17.25,52.91 v17.35,53.01
IO11  (via drill 0.25)
  Top 0.203: J3.18 v14.75,39.67 v14.76,39.67 | v14.76,50.16 14.76,51.56 14.63,51.69 14.62,51.69 U1.19
  Bottom 0.203: v14.76,39.67 v14.76,50.16
IO12  (via drill 0.25)
  Top 0.203: J3.17 v15.25,40.12 v15.24,40.13 | 15.85,51.66 15.77,51.59 15.77,51.08 v15.24,50.55 | 15.85,51.66 15.88,51.69 15.85,51.66 | 15.85,51.66 U1.20
  Bottom 0.203: v15.24,40.13 15.24,49.91 v15.24,50.55 | v15.24,50.55 15.24,50.57 v15.24,50.55
IO13  (via drill 0.25)
  Top 0.203: J3.16 v15.75,39.65 | U1.21 17.17,51.66 17.07,51.56 17.07,51.16 16.51,50.6 16.1,50.6 v15.75,50.24 | U1.21 17.12,51.64 17.12,51.66 U1.21 | U1.21
  Bottom 0.203: v15.75,39.65 15.75,49.28 v15.75,50.24 | v15.75,50.24 15.75,50.27 v15.75,50.24
IO14  (via drill 0.25)
  Top 0.203: 18.44,51.77 18.41,51.79 18.36,51.79 18.34,51.77 18.34,51.69 18.37,51.66 U1.22 18.36,51.7 18.36,51.71 18.39,51.69 18.39,51.21 17.78,50.6 v17.78,50.42 | J3.12 v17.75,39.62
  Bottom 0.203: v17.75,39.62 17.75,50.39 v17.78,50.42
IO15  (via drill 0.25)
  Top 0.203: J3.21 v13.25,40.17 v13.26,40.18 | v13.26,59.33 12.72,59.33 11.56,60.5 7.75,60.5 7.75,60.55
  Top 0.254: U1.8 7.75,60.55
  Bottom 0.203: v13.26,40.18 v13.26,59.33
IO16  (via drill 0.25)
  Top 0.203: J3.20 v13.75,39.69 v13.74,39.7 | v13.74,58.8 12.55,58.8 8.69,58.8 8.23,59.26 U1.9 7.77,59.23 U1.9
  Bottom 0.203: v13.74,39.7 v13.74,58.8
IO17/I2C_SDA  (via drill 0.2)
  Top 0.203: v9.45,57.99 9.14,57.99 U1.10 6.8,57.99 6.6,58.19 6.6,61.72 4.52,63.8 3.85,63.8 J6.2 | R27.1 15.21,47.87 15.21,47.88 13.82,49.28 v9.45,49.28 | v21.49,29.11 27.53,29.11 27.53,29.02 U8.6 | v9.45,49.28 9.42,49.28 v9.45,49.28
  Top 0.254: U7.14 15.5,47.09 15.21,47.37 15.21,47.78 15.16,47.83 R27.1
  Bottom 0.203: v9.45,49.28 v9.45,57.99 | v9.45,49.28 9.45,49.25 | 9.45,49.25 9.45,42.6 10.13,41.91 10.13,40.46 v21.49,29.11 | v9.45,49.28 9.45,49.25
IO18/I2C_SCL  (via drill 0.2)
  Top 0.203: 16,47.66 15.98,47.69 15.98,48.03 15.98,48.26 14.68,49.55 14.45,49.78 v8.89,49.78 | v8.89,56.67 7.8,56.67 arc-90 U1.11 v6.58,56.72 | J6.1 5.64,64.82 v6.25,64.21 | v21.82,28.3 27.74,28.3 28.07,28.63 U8.7
  Top 0.254: U7.13 16,47.29 16,47.3 16,47.66 R16.1
  Bottom 0.203: v8.89,56.67 v8.89,49.78 8.89,42.34 9.6,41.63 9.6,40.23 21.06,28.78 21.54,28.3 v21.82,28.3 | v6.25,64.21 6.25,57.05 v6.58,56.72
IO19  (via drill 0.2, 0.3)
  Top 0.203: R33.1 15.19,11.56 v14.17,12.57
  Top 0.254: J5.1 3.76,58.19 5.41,58.19 5.89,57.71 5.89,55.09 6.63,54.36 6.8,54.18 U1.13 7.52,54.18 | R34.2 7.52,42.37 v7.14,41.99 | v6.5,54.81 7.14,54.18 7.29,54.18 7.52,54.18 | 7.52,54.18 7.77,54.18
  Bottom 0.203: v6.5,54.81 7.14,54.18 v7.14,41.99 7.14,41.76 8.53,40.36 8.53,32.44 8.51,32.41 4.45,28.35 4.45,20.62 8.81,16.26 11.15,16.26 14.2,13.21 14.2,12.6
  Bottom 0.254: 14.2,12.6 v14.17,12.57
IO20  (via drill 0.3)
  Top 0.203: 16.2,10.39 16.2,11.63 v15.32,12.52
  Top 0.254: J5.2 3.87,57.23 5.08,57.23 5.36,56.95 5.36,54.53 6.98,52.91 U1.14 | U1.14 7.75,52.93 7.75,52.83 | R20.1 16.2,10.39 | v8.05,52.05 8.05,52.63 7.87,52.81 7.85,52.81 7.82,52.83 7.77,52.83 7.77,52.89 U1.14
  Bottom 0.203: v8.05,52.05 7.9,51.89 7.62,51.61 7.62,42.32 7.62,42.04 9.07,40.59 9.14,40.51 9.14,39.37 9.14,32.16 5.13,28.14 5.13,20.8 9.04,16.89 11.33,16.89 15.32,12.9 v15.32,12.52
IO21  (via drill 0.25)
  Top 0.203: v19.25,50.72 19.61,51.08 19.61,51.28 | v19.25,50.72 19.58,51.05 19.58,51.51 19.71,51.64 U1.23 | J3.9 v19.25,40.05 v19.25,40.06 | v19.25,50.72 19.63,51.1 | 19.63,51.1 19.68,51.16 19.68,51.18 19.63,51.13 19.63,51.1 | 19.63,51.1 19.61,51.13 19.61,51.26
  Bottom 0.203: v19.25,40.06 v19.25,50.72
IO38  (via drill 0.25)
  Top 0.203: TF.P7 23.68,42.11 v23.65,42.14 | v23.65,57.89 25.15,57.89 U1.31
  Bottom 0.203: v23.65,42.14 v23.65,57.89
IO39  (via drill 0.25)
  Top 0.203: TF.P5 v26.53,44.31 v26.52,44.3 v22.25,44.3 | v26.52,59.26 U1.32 | J3.3 v22.25,39.98
  Bottom 0.203: v26.52,44.3 v26.52,59.26 | v22.25,39.98 v22.25,44.3
IO40  (via drill 0.25, 0.3)
  Top 0.203: 31.09,46.48 31.14,46.53 31.17,46.53 31.09,46.53 31.06,46.51 TF.P3 31,46.48 v27.23,46.48 | U1.33 v27.23,60.53 | v27.23,40.64 22,40.64 21.74,40.39 21.74,38.66 21.74,38.63 J3.4
  Bottom 0.203: v27.23,60.53 v27.23,46.48 v27.23,40.64
IO41  (via drill 0.25)
  Top 0.203: J3.10 v18.75,39.57 | v18.75,61.7 25.15,61.7 U1.34
  Bottom 0.203: v18.75,39.57 v18.75,61.7
IO42  (via drill 0.25)
  Top 0.203: TF.P2 v27.9,47.61 | v27.9,47.61 v27.89,47.6 | v27.89,63.04 25.28,63.04 U1.35 | v27.9,47.61 23.49,47.61 R12.1
  Bottom 0.203: v27.89,47.6 v27.89,63.04
IO45  (via drill 0.25)
  Top 0.254: J3.2 22.76,38.63 v22.76,39.52 | v22.99,50.62 23.5,51.13 23.5,51.66 U1.26
  Bottom 0.254: v22.76,39.52 22.76,50.39 v22.99,50.62
IO46  (via drill 0.25, 0.3)
  Top 0.203: U1.16 10.79,51.15 10.06,50.42 8.56,50.42 7.19,51.79 6.86,51.79 v6.3,52.35 | v5.94,5 5.94,4.1 R28.2
  Bottom 0.203: v6.3,52.35 6.3,41.73 6.83,41.2 7.75,40.28 7.75,40.01 7.75,39.6 7.49,39.34 7.26,39.12 7.26,39.09 7.26,34.01 2.56,29.31 2.56,7.44 5,5 v5.94,5
IO47  (via drill 0.25)
  Top 0.203: 20.75,51 20.75,51.44 | 20.75,51.44 20.75,51.51 | 20.75,51.44 20.75,51.47 U1.24 20.95,51.3 20.88,51.23 20.88,51.13 v20.25,50.5 | J3.7 20.27,38.64 v20.27,39.98
  Bottom 0.203: v20.27,39.98 20.27,50.5 v20.25,50.5
IO48  (via drill 0.25)
  Top 0.203: U1.25 21.97,51.42 21.97,50.98 21.41,50.42 v21.03,50.42 | J3.6 v20.75,39.5
  Bottom 0.203: v20.75,39.5 20.75,50.14 v21.03,50.42
LCD_RST  (via drill 0.2)
  Top 0.203: v10.36,33.33 5.82,33.33 5.26,33.88 | 5.26,33.88 R18.2 | R2.2 C14.2 arc-90 5.26,34.23 5.26,33.88 | J3.27 10.25,37.86 v10.36,37.74
  Top 0.305: 5.26,37.2 R18.2
  Bottom 0.203: v10.36,37.74 v10.36,33.33
LED+  (via drill 0.25, 0.3)
  Top 0.203: J3.30 8.68,38.56 8.64,38.56
  Top 0.305: v4.52,9.55 3.66,9.55 C12.2 3.61,9.65 C11.2 3.63,11.07 3.63,11.58 3.99,11.94 D1.-
  Top 0.406: U2.5 v7.26,7.29 | 8.64,38.56 v7.95,38.56
  Bottom 0.406: v7.26,7.29 6.78,7.29 v4.52,9.55 3.58,10.49 3.58,28.83 7.87,33.12 7.87,37.24 7.87,38.48 v7.95,38.56
LED-  (via drill 0.2, 0.3)
  Top 0.203: 4.14,6.33 4.14,6.38 R32.2
  Top 0.305: U2.3 5.68,6.38 3.56,6.38 | J3.29 9.25,37.7 9.25,37.69
  Top 0.406: 3.56,6.38 v3.56,5.44 | v4.78,32.59 v9.68,32.59 | 9.25,37.69 9.58,37.36 v9.7,37.36
  Top 0.559: U2.3 5.67,6.33 4.14,6.33 4.04,6.43 2.79,6.43 2.82,6.45 R3.2
  Bottom 0.406: v3.56,5.44 1.75,7.24 1.75,29.57 v4.78,32.59 | v9.68,32.59 9.68,37.29 arc-90 v9.7,37.36
N$1
  Top 0.254: R22.1 23.74,49.19 23.9,49.02 29.84,49.02 30.18,48.69 31.01,48.69 TF.P1
N$2
  Top 0.203: TF.P8 23.64,41.36 22.53,42.47 21.39,43.61 21.39,43.81 21.37,43.81 R10.1
N$3
  Top 0.203: 27.71,26.8 27.71,26.84 C5.1
  Top 0.305: C26.1 27.75,26.76 27.71,26.8 | R35.1 C5.1
N$4
  Top 0.203: U8.1 29.57,32.67 30.1,33.2 30.1,34.39 30.45,34.75 30.45,34.82 Q3.P$1
  Top 0.406: C19.2 30.1,33.2
N$5  (1 unrouted)
  Top 0.254: U9.P$10 8.81,47.96 8.38,48.39 8.15,48.39
N$6
  Top 0.305: USB-NATIVE.A5 14.75,7.83 14.15,8.43
  Top 0.406: R15.2 14.15,8.42 14.15,8.43
N$7
  Top 0.406: R1.1 1.75,34.39 1.68,34.47 1.7,34.49 PWR.C
N$8
  Top 0.406: Q2.1 7.37,2.97
  Top 0.559: R13.2 7.37,2.17 7.37,2.97 7.37,3.02 7.29,3.1 6.2,3.1 6.18,3.09 R28.1
N$9
  Top 0.254: R30.1 6.36,48.39 C39.2 5.08,48.5 SPK.2
N$10
  Top 0.254: U10.4 1.8,42.62 2.23,43.05 2.23,43.5 R24.2 2.2,44.15 R26.1
N$11
  Top 0.254: U10.7 2.9,39.73 3.89,39.73 3.89,39.68 U10.8 3.9,38.35 FB1.2 3.75,38.38 C47.2
N$12
  Top 0.203: U8.4 28.07,32 27.79,32.28 26.81,32.28 R11.1
N$13
  Top 0.203: U8.2 29.07,32.86 C23.1 28.74,33.82 28.52,34.04 28.52,34.46 Q3.P$2
N$14
  Top 0.305: USB-NATIVE.B5 17.75,8.01 17.27,8.48 17.27,8.69
  Top 0.406: 17.27,8.69 17.25,8.69 R14.2
N$15  (1 unrouted)
  Top 0.254: SPK.1 4.84,49.43 6.3,49.43 | 6.3,49.43 R25.1 7.32,49.43 | 6.3,49.47 6.3,49.43
N$17
  Top 0.203: D1.+ 3.99,14.94 3.96,14.96 | 5.87,8.41 5.87,8.66 5.74,8.79 5.59,8.79 | 5.59,8.79 5.59,8.34 U2.1 | 5.26,8.38 5.61,8.74 5.64,8.74 5.61,8.71 5.59,8.74 5.59,8.79
  Top 0.61: 4.06,15.06 3.96,14.96 | L1.P$2 5.87,12.32 5.87,13.34 4.39,14.81 D1.+ 3.99,15.06 R23.2
  Top 0.813: L1.P$2 5.87,11.86 5.87,8.41
N$21
  Top 0.203: 9.3,47.27 9.3,47.31 U9.P$9
  Top 0.254: R25.2 8.29,49.28 8.59,49.28 9.3,48.56 9.3,47.27
N$22
  Top 0.61: C2.2 2.04,14.08 R23.1
N$23
  Top 0.508: U6.2 19.38,9.55 arc-90 19.36,9.53 | 19.36,9.53 19.41,9.53 | R21.2 19.36,9.53
N$24
  Top 0.559: R31.1 9.38,6.35 U2.4 | U2.4 8.15,6.35 | Q2.3 8.29,5.03 U2.4
N$29
  Top 0.406: R19.1 19.7,18.5 19.38,18.19 U6.7
N$30
  Top 0.406: R38.1 20.77,17.79 20.62,17.65 20.62,17.07 U6.6
N$31
  Top 0.406: R19.2 17.8,18.87 17.78,18.9 | 17.78,18.9 D8.C | D8.C 17.37,18.9 | D8.C 17.78,18.9
N$32
  Top 0.406: D9.C 19.85,20.27 R38.2
PCLK
  Top 0.203: J3.24 11.75,40.8 C21.2 11.89,41.01 FB2.1
RESET  (via drill 0.2, 0.25)
  Top 0.203: v4.52,36.17 4.52,35.38 R2.1 | R2.1 | R2.1 4.37,35.26 4.45,35.33 | C4.1 v5.27,67.12 v5.28,67.11 | 6.45,66.9 6.44,66.9 R36.1
  Top 0.254: U1.3 7.73,66.9 6.45,66.9 | R36.1 6.22,67.12 5.3,67.12 v5.28,67.11 | C4.1 3.57,67.69 RST.1
  Bottom 0.203: v5.28,67.11 3.86,65.68 3.86,46.23 3.86,45.59 4.52,44.93 v4.52,36.17
RXD/IO44  (via drill 0.25)
  Top 0.254: v18.54,65.79 20.45,64.29 20.45,64.26 25.17,64.26 arc90 U1.36 | R5.2 v5.66,42.04
  Bottom 0.254: v18.54,65.79 6.86,65.79 5.46,64.39 5.46,42.88 5.46,42.24 v5.66,42.04
TXD/IO43  (via drill 0.25)
  Top 0.254: R6.2 4.76,45.7 v4.6,45.7 | v18.54,66.57 21.31,66.57 22.3,65.58 25.09,65.58 25.12,65.56 25.2,65.56 U1.37
  Bottom 0.254: v4.6,45.7 4.6,64.52 6.66,66.57 v18.54,66.57
USB_D+
  Top 0.305: R20.2 16.18,9.16 16.18,8.41 16.18,7.72 | USB-NATIVE.A6 15.75,7.19 15.8,7.24 | 15.8,7.24 15.88,7.32 16.2,7.32 | 16.18,7.72 16.18,7.59 | 16.18,7.59 16.18,7.37 16.2,7.34 16.2,7.32 | USB-NATIVE.B6 16.75,7.12 16.76,7.14 16.71,7.19 | 16.71,7.19 16.59,7.32 16.2,7.32 | 15.8,7.24 16.15,7.59 16.18,7.59 | 16.71,7.19 16.18,7.72
USB_D-
  Top 0.305: R33.2 15.25,9.11 USB-NATIVE.B7 15.25,5.43 15.47,5.21 16.05,5.21 16.23,5.38 16.25,5.4 USB-NATIVE.A7
  Top 0.406: R33.2
VBAT
  Top 0.305: C28.2 25.58,18.62 | 25.58,18.62 24.97,19.33 | 25.58,18.62 25.6,18.82 26.06,19.28 26.01,19.3 25.58,19.74 25.53,19.74 25.15,19.36 | 25.09,14.12 25.55,14.58 26.04,14.1 26.04,14.08
  Top 0.508: U6.5 21.92,17.93 23.32,19.33 24.97,19.33 27.4,19.33 | 27.4,19.33 BAT.1 | 27.4,19.33 27.51,19.33 27.33,19.33 27.3,19.36 | C28.2 25.58,18.62 25.58,14.11 25.6,14.08
  Top 0.61: Q1.3 25.6,14.08 26.04,14.08 26.21,14.08 arc90 D11.+
VOUT  (via drill 0.3, 0.41)
  Top 0.254: U8.10 29.57,26.8 29.49,26.8 29.48,26.8
  Top 0.305: C18.2 29.6,26.86 29.57,26.82 29.57,26.86 R35.2 | 29.48,26.8 R35.2 | 29.44,26.8 29.48,26.8 | 29.48,26.8 R35.2
  Top 0.406: D11.- 26.42,11.93 | 26.42,11.93 26.42,11.94 | 26.42,11.94 v26.42,12.8 | v29.49,25.86 29.49,26.75 29.44,26.8 29.44,26.81 | 26.42,11.93 26.42,11.94
  Top 0.508: D2.- 26.42,10.64 C34.2 26.89,9.21 26.98,9.3
  Top 0.61: Q1.2 25.2,11.94 26.42,11.94 | D2.- 26.47,10.69 D11.-
  Top 0.813: PWR1.1 27.59,9.3 26.98,9.3
  Top 1.016: PWR1.1 28.73,9.09 30.12,9.09 30.59,8.62 PWR1.1@1
  Bottom 0.406: v26.42,12.8 26.42,16.13 29.49,19.2 v29.49,25.86
VPWR  (via drill 0.3)
  Top 0.559: 9.05,8.26 8.41,8.26 8.39,8.24 U2.6
  Top 0.61: U4.1 1.92,17.79 2.29,17.42 3.56,17.42 3.81,17.68 U4.3 5.12,18.79 U5.1 5.15,17.69 5.41,17.42 | U5.3 7.05,17.76 C41.2 | 7.02,17.42 C41.2 | 5.41,17.42 9.55,17.42 | 9.55,17.42 9.73,17.6 | U3.1 9.69,13.45 9.96,13.18 9.93,13.18 9.91,13.21 9.91,12.2 L1.P$1 | L1.P$1 10.01,12.09 9.96,12.09 9.83,12.22 9.8,12.22 9.78,12.22 9.73,12.17 | U3.1 9.69,19.85 10.11,20.27 11.28,20.27 11.58,19.96 11.58,19 U3.3 | U3.1 9.69,17.74 9.73,17.7 | 9.73,17.7 9.74,17.72 C37.2 9.72,17.75 C15.2 C17.2 | 9.73,17.7 9.73,17.6 | 9.73,17.6 9.55,17.42 | 5.41,17.42 5.91,17.42 C6.2 6.99,17.29 C41.2 | 8.28,8.26 9.05,8.26 9.42,8.62 9.42,10.49 9.8,10.87 L1.P$1 | R31.2 9.73,8.66 9.75,8.69 9.47,8.69 9.14,8.36 9.32,8.36 9.6,8.08 9.6,8.91 9.73,9.04
  Top 1.016: PWR1.2@1 v29.52,11.12 | v29.52,11.12 PWR1.2 | PWR1.2 28.04,11.12 | PWR1.2 v29.52,11.12 | L1.P$1 9.96,12.09 9.96,12.14 9.93,12.14 v9.93,9.04 9.73,9.04
  Bottom 1.016: v29.52,11.12 27.43,9.04 v9.93,9.04

### Text on the board
tPlace: IO18 | SCL | IO17 | SDA | 3V3 | GND | IO19 | IO20 | 3V3 | GND | + | - | www.makerfabs.com | V- | V+
bPlace: TFT 3.16" ST7701S v1.0 | ESP32-S3 Parallel | - | +